# Altium project PCB_Project.PrjPcb (part 2 of 4)

## Sheet ST-LINK.SchDoc
size 420 x 297 mm; Date: 22.03.2024; ApprovedBy: Arda B.; CheckedBy: Arda B.; DrawnBy: Arda Bozkurt; Revision: 001; SheetNumber: 6; SheetTotal: 9; Size: A3; Departmant: HDD; DOC_NO_ASSY_: __; Time: 22.03.2024
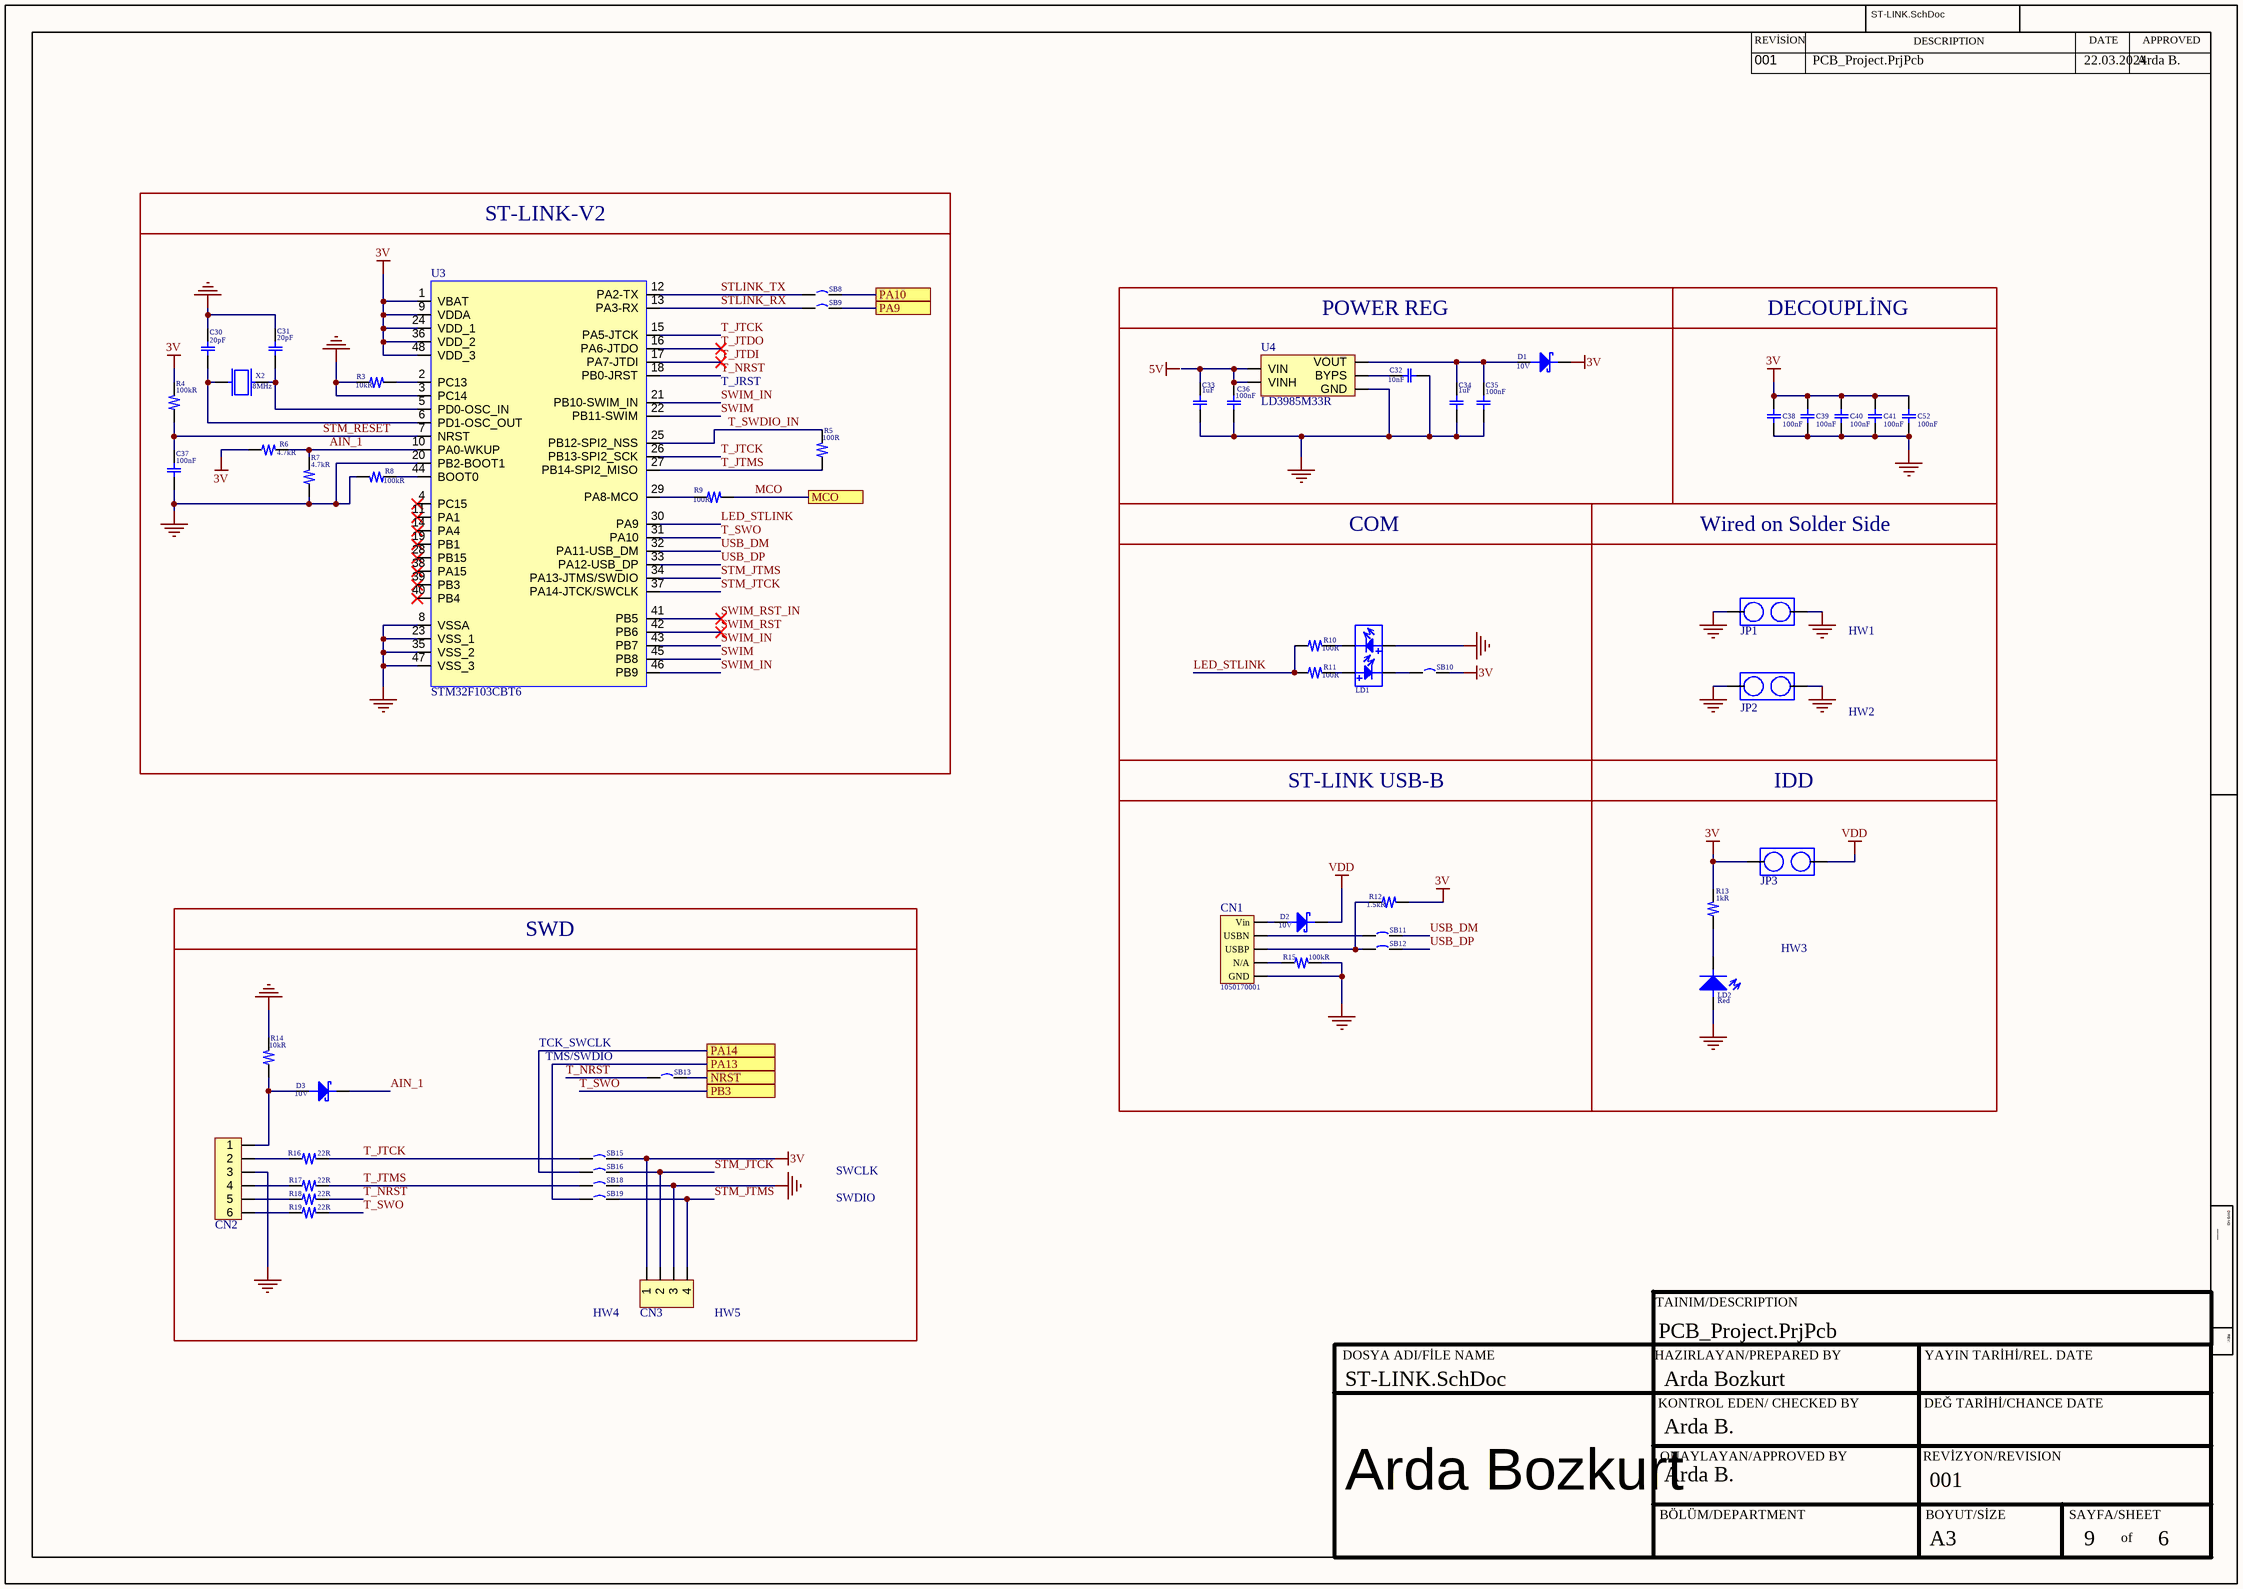
[diagram p5: ST-LINK.SchDoc]

### Parts
C30  value 20pF  [CAP-0402]  (hidden comment: CC0402JRNPO9BN200)
C31  value 20pF  [CAP-0402]  (hidden comment: CC0402JRNPO9BN200)
C32  value 10nF  [CAP-0603]  (hidden comment: CC0603KRX7R9BB103)
C33  value 1uF  [CAP-0603]  (hidden comment: CC0603KRX5R8BB105)
C34  value 1uF  [CAP-0603]  (hidden comment: CC0603KRX5R8BB105)
C35  value 100nF  [CAP-0402]  (hidden comment: CC0402KRX7R7BB104)
C36  value 100nF  [CAP-0402]  (hidden comment: CC0402KRX7R7BB104)
C37  value 100nF  [CAP-0402]  (hidden comment: CC0402KRX7R7BB104)
C38  value 100nF  [CAP-0402]  (hidden comment: CC0402KRX7R7BB104)
C39  value 100nF  [CAP-0402]  (hidden comment: CC0402KRX7R7BB104)
C40  value 100nF  [CAP-0402]  (hidden comment: CC0402KRX7R7BB104)
C41  value 100nF  [CAP-0402]  (hidden comment: CC0402KRX7R7BB104)
C52  value 100nF  [CAP-0402]  (hidden comment: CC0402KRX7R7BB104)
CN1  1050170001  [USB MİCRO B]
CN2  TS-106-G-A  [CONN-6POS]  (value not drawn)
CN3  61300411121  [CONN-4POS]  (value not drawn)
D1  Peak Voltage: 10V  [SOD-323]  (hidden comment: BAT60JFILM)
D2  Peak Voltage: 10V  [SOD-323]  (hidden comment: BAT60JFILM)
D3  Peak Voltage: 10V  [SOD-323]  (hidden comment: BAT60JFILM)
HW1  MNT-101-BK-G  [SHUNT]  (value not drawn)
HW2  MNT-101-BK-G  [SHUNT]  (value not drawn)
HW3  MNT-101-BK-G  [SHUNT]  (value not drawn)
HW4  MNT-101-BK-G  [SHUNT]  (value not drawn)
HW5  MNT-101-BK-G  [SHUNT]  (value not drawn)
JP1  61300211121  [CONN-2PİNS]  (value not drawn)
JP2  61300211121  [CONN-2PİNS]  (value not drawn)
JP3  61300211121  [CONN-2PİNS]  (value not drawn)
LD1  67-22SURSYGC/S530-A2/TR8  [LED-RED-GREEN-SMD]  (value not drawn)
LD2  Color: Red  [LED-RED-0603]  (hidden comment: 150060RS75000)
R3  value 10kR  [RES-0402]  (hidden comment: RC0402FR-0710KL)
R4  value 100kR  [RES-0402]  (hidden comment: RC0402FR-07100KL)
R5  value 100R  [RES-0402]  (hidden comment: RC0402FR-07100RL)
R6  value 4.7kR  [RES-0402]  (hidden comment: RC0402FR-074K7L)
R7  value 4.7kR  [RES-0402]  (hidden comment: RC0402FR-074K7L)
R8  value 100kR  [RES-0402]  (hidden comment: RC0402FR-07100KL)
R9  value 100R  [RES-0402]  (hidden comment: RC0402FR-07100RL)
R10  value 100R  [RES-0402]  (hidden comment: RC0402FR-07100RL)
R11  value 100R  [RES-0402]  (hidden comment: RC0402FR-07100RL)
R12  value 1.5kR  [RES-0402]  (hidden comment: RC0402FR-071K5L)
R13  value 1kR  [RES-0402]  (hidden comment: RC0402FR-071KL)
R14  value 10kR  [RES-0402]  (hidden comment: RC0402FR-0710KL)
R15  value 100kR  [RES-0402]  (hidden comment: RC0402FR-07100KL)
R16  value 22R  [RES-0603]  (hidden comment: RC0603FR-0722RL)
R17  value 22R  [RES-0603]  (hidden comment: RC0603FR-0722RL)
R18  value 22R  [RES-0603]  (hidden comment: RC0603FR-0722RL)
R19  value 22R  [RES-0603]  (hidden comment: RC0603FR-0722RL)
SB8  RC0402JR-070RL  [RES-0402]  (value not drawn)
SB9  RC0402JR-070RL  [RES-0402]  (value not drawn)
SB10  RC0402JR-070RL  [RES-0402]  (value not drawn)
SB11  RC0402JR-070RL  [RES-0402]  (value not drawn)
SB12  RC0402JR-070RL  [RES-0402]  (value not drawn)
SB13  RC0402JR-070RL  [RES-0402]  (value not drawn)
SB15  RC0402JR-070RL  [RES-0402]  (value not drawn)
SB16  RC0402JR-070RL  [RES-0402]  (value not drawn)
SB18  RC0402JR-070RL  [RES-0402]  (value not drawn)
SB19  RC0402JR-070RL  [RES-0402]  (value not drawn)
U3  STM32F103CBT6  [LQFP-48]
U4  LD3985M33R  [SOT23-5L]
X2  Frequency: 8MHz  [HC-49US]  (hidden comment: H1OED8K5SC-112YXC-8M)

### Ports
MCO (see TOP[3B]), NRST (see TOP[3B]), PA9 (see TOP[3B]), PA10 (see TOP[3B]), PA13 (see TOP[3B], Micro Controller[4A]), PA14 (see TOP[3B]), PB3 (see TOP[3B])

### Nets
3V: C38.2 C39.2 C40.2 C41.2 C52.2 CN3.1 D1.1 JP3.1 R4.2 R6.1 R12.2 R13.2 SB10.2 SB15.2 U3.1(VBAT) U3.9(VDDA) U3.24(VDD_1) U3.36(VDD_2) U3.48(VDD_3)
GND: C30.2 C31.2 C32.2 C33.1 C34.1 C35.1 C36.1 C37.1 C38.1 C39.1 C40.1 C41.1 C52.1 CN1.5(GND) CN2.3 CN3.3 JP1.1 JP1.2 JP2.1 JP2.2 LD1.1 LD2.2 R3.1 R7.1 R8.2 R14.2 R15.2 SB18.2 U3.3(PC14) U3.8(VSSA) U3.20(PB2-BOOT1) U3.23(VSS_1) U3.35(VSS_2) U3.47(VSS_3) U4.2(GND)
VDD: D2.1 JP3.2
AIN_1: D3.1 R6.2 R7.2 U3.10(PA0-WKUP)
LED_STLINK: R10.1 R11.1 U3.30(PA9)
MCO: R9.2 ; port MCO
NRST: SB13.2 ; port NRST
STLINK_RX: SB9.1 U3.13(PA3-RX)
STLINK_TX: SB8.1 U3.12(PA2-TX)
STM_JTCK: CN3.2 SB16.2 U3.37(PA14-JTCK/SWCLK)
STM_JTMS: CN3.4 SB19.2 U3.34(PA13-JTMS/SWDIO)
STM_RESET: C37.2 R4.1 U3.7(NRST)
SWIM: U3.22(PB11-SWIM) U3.45(PB8)
SWIM_IN: U3.21(PB10-SWIM_IN) U3.43(PB7) U3.46(PB9)
SWIM_RST: U3.42(PB6)
SWIM_RST_IN: U3.41(PB5)
T_JTCK: R16.2 SB15.1 U3.15(PA5-JTCK) U3.26(PB13-SPI2_SCK)
T_JTDI: U3.17(PA7-JTDI)
T_JTDO: U3.16(PA6-JTDO)
T_JTMS: R5.1 R17.2 SB18.1 U3.27(PB14-SPI2_MISO)
T_NRST: R18.2 SB13.1 U3.18(PB0-JRST)
T_SWDIO_IN: R5.2 U3.25(PB12-SPI2_NSS)
T_SWO: R19.2 U3.31(PA10) ; port PB3
USB_DM: SB11.2 U3.32(PA11-USB_DM)
USB_DP: SB12.2 U3.33(PA12-USB_DP)
NetC30_1: C30.1 U3.6(PD1-OSC_OUT) X2.1
NetC31_1: C31.1 U3.5(PD0-OSC_IN) X2.2
NetC32_1: C32.1 U4.4(BYPS)
NetC33_2: C33.2 C36.2 U4.1(VIN) U4.3(VINH)
NetC34_2: C34.2 C35.2 D1.2 U4.5(VOUT)
NetCN1_1: CN1.1(Vin) D2.2
NetCN1_2: CN1.2(USBN) SB11.1
NetCN1_3: CN1.3(USBP) R12.1 SB12.1
NetCN1_4: CN1.4(N/A) R15.1
NetCN2_1: CN2.1 D3.2 R14.1
NetCN2_2: CN2.2 R16.1
NetCN2_4: CN2.4 R17.1
NetCN2_5: CN2.5 R18.1
NetCN2_6: CN2.6 R19.1
NetLD1_2: LD1.2 R10.2
NetLD1_3: LD1.3 R11.2
NetLD1_4: LD1.4 SB10.1
NetLD2_1: LD2.1 R13.1
NetR3_2: R3.2 U3.2(PC13)
NetR8_1: R8.1 U3.44(BOOT0)
NetR9_1: R9.1 U3.29(PA8-MCO)
NetSB8_2: SB8.2 ; port PA10
NetSB9_2: SB9.2 ; port PA9
NetSB16_1: SB16.1 ; port PA14
NetSB19_1: SB19.1 ; port PA13

Not connected (* = marked no-connect by the designer): U3 4(PC15)* 11(PA1)* 14(PA4)* 19(PB1)* 28(PB15)* 38(PA15)* 39(PB3)* 40(PB4)*

### Notes on the sheet
- ST-LINK-V2
- POWER REG
- DECOUPLİNG
- T_JRST
- COM
- Wired on Solder Side
- ST-LINK USB-B
- IDD
- SWD
- TCK_SWCLK
- TMS/SWDIO
- SWCLK
- SWDIO
- Labels drawn without touching a wire or pin: 5V
- REVİSİON
- DESCRIPTION
- DATE
- APPROVED
- DWG NO:
- TAINIM/DESCRIPTION
- REV:
- DOSYA ADI/FİLE NAME
- HAZIRLAYAN/PREPARED BY
- KONTROL EDEN/ CHECKED BY
- YAYIN TARİHİ/REL. DATE
- DEĞ TARİHİ/CHANCE DATE
- ONAYLAYAN/APPROVED BY
- REVİZYON/REVISION
- Arda Bozkurt
- BÖLÜM/DEPARTMENT
- BOYUT/SİZE
- SAYFA/SHEET
- of

### Library data of the parts
C30 C31 = CAP CER 20PF 50V C0G/NPO 0402: Manufacturer: Yageo; Temperature Coefficient: 30ppm/°C; Supplier: Future Electronics; Supplier Part Number: 9739384; Manufacturer Part Number: CC0402JRNPO9BN200; RoHS: Yes; Category: Ceramic Capacitors; Stock: 60000; Pricing: 10000=0,0025, 40000=0,0023, 150000=0,0022, 300000=0,0022, 750000=0,002 (USD); Halogen Free: 5694HalogenFree; ComponentLink1URL: https://datasheet.ciiva.com/176/mlccorderingcode-176360.pdf?src-supplier=Digikey; ComponentLink1Description: https://datasheet.ciiva.com/176/mlccorderingcode-176360.pdf?src-supplier=Digikey; ComponentLink2URL: https://datasheet.ciiva.com/176/mlccorderingcode-176361.pdf?src-supplier=Digikey; ComponentLink2Description: https://datasheet.ciiva.com/176/mlccorderingcode-176361.pdf?src-supplier=Digikey; ComponentLink3URL: https://datasheet.ciiva.com/176/mlccorderingcode-176362.pdf?src-supplier=Digikey; ComponentLink3Description: https://datasheet.ciiva.com/176/mlccorderingcode-176362.pdf?src-supplier=Digikey; ComponentLink4URL: https://datasheet.ciiva.com/7656/1132289-7656614.pdf?src-supplier=Element14; ComponentLink4Description: https://datasheet.ciiva.com/7656/1132289-7656614.pdf?src-supplier=Element14; ComponentLink5URL: https://datasheet.ciiva.com/5427/upy-gp-np0-16v-to-50v-8-3714-5427769.pdf?src-supplier=Mouser; ComponentLink5Description: https://datasheet.ciiva.com/5427/upy-gp-np0-16v-to-50v-8-3714-5427769.pdf?src-supplier=Mouser
C32 = CAP CER 10nF 50V X7R 0603: Multilayer Ceramic Capacitor, 0.01 uF, 50 V, ± 10%, X7R, 0603 [1608 Metric]; Manufacturer: Yageo; Voltage: 50V; Insulation Resistance: 100GR; Supplier: Future Electronics; Supplier Part Number: 4131256; Manufacturer Part Number: CC0603KRX7R9BB103; RoHS: Yes; Category: Ceramic Capacitors; Stock: 5740000; Pricing: 4000=0,0037, 16000=0,0032, 40000=0,0034, 80000=0,003, 120000=0,0033, 160000=0,0029, 500000=0,0031, 1200000=0,0029 (USD); Mounting Technology: Surface Mount; Case/Package: 0603; Pins: 2; Material: Ceramic; Case Code (Metric): 1608; Case Code (Imperial): 0603; Min Operating Temperature: -55°C; Max Operating Temperature: 125°C; Tolerance: 10%; Dielectric: X7R; Packaging: Tape and Reel; Voltage Rating: 50V; Voltage Rating (DC): 50V; Package Quantity: 1; Termination: SMD/SMT; Series: CC; Length: 1.6mm; Width: 0.031inch; Height: 0.8mm; Thickness: 0.035inch; Depth: 0.8mm; Radiation Hardening: No; RoHS Compliant: Yes; Reach SVHC Compliant: Unknown; Halogen Free: 5694HalogenFree; Lead Free: 5697LeadFree; ComponentLink1URL: https://datasheet.ciiva.com/11788/0900766b8079c870-11788374.pdf?src-supplier=Rs; ComponentLink1Description: https://datasheet.ciiva.com/11788/0900766b8079c870-11788374.pdf?src-supplier=Rs; ComponentLink2URL: https://datasheet.ciiva.com/26862/getdatasheetpartid-403582-26862846.pdf?src-supplier=Verical; ComponentLink2Description: https://datasheet.ciiva.com/26862/getdatasheetpartid-403582-26862846.pdf?src-supplier=Verical; ComponentLink3URL: https://datasheet.ciiva.com/8033/70765-8033817.pdf?src-supplier=Element14; ComponentLink3Description: https://datasheet.ciiva.com/8033/70765-8033817.pdf?src-supplier=Element14; ComponentLink4URL: https://datasheet.ciiva.com/28450/1489800-28450619.pdf?src-supplier=Element14; ComponentLink4Description: https://datasheet.ciiva.com/28450/1489800-28450619.pdf?src-supplier=Element14; ComponentLink5URL: https://datasheet.ciiva.com/176/mlccorderingcode-176550.pdf?src-supplier=Digikey; ComponentLink5Description: https://datasheet.ciiva.com/176/mlccorderingcode-176550.pdf?src-supplier=Digikey; ComponentLink6URL: https://datasheet.ciiva.com/176/mlccorderingcode-176552.pdf?src-supplier=Digikey; ComponentLink6Description: https://datasheet.ciiva.com/176/mlccorderingcode-176552.pdf?src-supplier=Digikey; ComponentLink7URL: https://datasheet.ciiva.com/8033/1734573-8033816.pdf?src-supplier=Element14; ComponentLink7Description: https://datasheet.ciiva.com/8033/1734573-8033816.pdf?src-supplier=Element14; ComponentLink8URL: https://datasheet.ciiva.com/8033/1734573-8033861.pdf?src-supplier=Element14; ComponentLink8Description: https://datasheet.ciiva.com/8033/1734573-8033861.pdf?src-supplier=Element14; ComponentLink9URL: https://datasheet.ciiva.com/176/mlccorderingcode-176551.pdf?src-supplier=Digikey; ComponentLink9Description: https://datasheet.ciiva.com/176/mlccorderingcode-176551.pdf?src-supplier=Digikey; ComponentLink10URL: https://datasheet.ciiva.com/13389/upy-gphc-x7r-6-3v-to-50v-8-13389991.pdf?src-supplier=Mouser; ComponentLink10Description: https://datasheet.ciiva.com/13389/upy-gphc-x7r-6-3v-to-50v-8-13389991.pdf?src-supplier=Mouser
C33 C34 = CAP CER 1UF 25V X5R 0603: Multilayer Ceramic Capacitor, 1 uF, 25 V, ± 10%, X5R, 0603 [1608 Metric]; Manufacturer: Yageo; Material: 4241ConductorMaterial; Voltage Rating: 25V; Supplier: Future Electronics; Supplier Part Number: 5636071; Manufacturer Part Number: CC0603KRX5R8BB105; RoHS: Yes; Category: Ceramic Capacitors; Stock: 3696000; Pricing: 4000=0,0113, 16000=0,0107, 40000=0,0104, 100000=0,0101, 160000=0,0095 (USD); Mounting Technology: Surface Mount; Case/Package: 0603; Pins: 2; Case Code (Metric): 1608; Case Code (Imperial): 0603; Min Operating Temperature: -55°C; Max Operating Temperature: 85°C; Tolerance: 10%; Dielectric: X5R; Packaging: Tape and Reel; Termination: SMD/SMT; Series: CC; Construction: Flat; Voltage Rating (DC): 25V; Length: 1.6mm; Height: 0.8mm; Depth: 0.8mm; Radiation Hardening: No; Reach SVHC Compliant: No; RoHS Compliant: Yes; Halogen Free: 5694HalogenFree; Lead Free: 5697LeadFree; ComponentLink1URL: https://datasheet.ciiva.com/7978/1525783-7978171.pdf?src-supplier=Element14; ComponentLink1Description: https://datasheet.ciiva.com/7978/1525783-7978171.pdf?src-supplier=Element14; ComponentLink2URL: https://datasheet.ciiva.com/176/mlccorderingcode-176786.pdf?src-supplier=Digikey; ComponentLink2Description: https://datasheet.ciiva.com/176/mlccorderingcode-176786.pdf?src-supplier=Digikey; ComponentLink3URL: https://datasheet.ciiva.com/176/mlccorderingcode-176785.pdf?src-supplier=Digikey; ComponentLink3Description: https://datasheet.ciiva.com/176/mlccorderingcode-176785.pdf?src-supplier=Digikey; ComponentLink4URL: https://datasheet.ciiva.com/176/mlccorderingcode-176787.pdf?src-supplier=Digikey; ComponentLink4Description: https://datasheet.ciiva.com/176/mlccorderingcode-176787.pdf?src-supplier=Digikey; ComponentLink5URL: https://datasheet.ciiva.com/11586/upy-gphc-x5r-4v-to-50v-12-11586318.pdf?src-supplier=Avnet; ComponentLink5Description: https://datasheet.ciiva.com/11586/upy-gphc-x5r-4v-to-50v-12-11586318.pdf?src-supplier=Avnet
C35-C41 C52 = CAP CER 100nF 16V X7R 0402: Multilayer Ceramic Capacitor, 0.1 uF, 25 V, ± 10%, X7R, 0402 [1005 Metric]; Manufacturer: Yageo; Material: 4241ConductorMaterial; Voltage Rating: 16V; Temperature Coefficient: 30ppm/°C; Supplier: Future Electronics; Supplier Part Number: 8517856; Manufacturer Part Number: CC0402KRX7R7BB104; RoHS: Yes; Category: Ceramic Capacitors; Stock: 30330000; Pricing: 10000=0,0028, 40000=0,0027, 150000=0,0025, 300000=0,0025, 750000=0,0023 (USD); Mounting Technology: Surface Mount; Case/Package: 0402; Pins: 2; Case Code (Metric): 1005; Case Code (Imperial): 0402; Min Operating Temperature: -55°C; Max Operating Temperature: 125°C; Tolerance: 10%; Dielectric: X7R; Voltage Rating (DC): 16V; Packaging: Tape and Reel; Package Quantity: 1; Termination: SMD/SMT; Voltage: 16V; Series: CC; Voltage Rating (AC): 16V; Length: 1mm; Width: 0.02inch; Height: 0.5mm; Thickness: 0.022inch; Depth: 0.5mm; Radiation Hardening: No; RoHS Compliant: Yes; Reach SVHC Compliant: No; Halogen Free: 5694HalogenFree; Lead Free: 5697LeadFree; ComponentLink1URL: https://datasheet.ciiva.com/11788/0900766b80ce67ed-11788364.pdf?src-supplier=Rs; ComponentLink1Description: https://datasheet.ciiva.com/11788/0900766b80ce67ed-11788364.pdf?src-supplier=Rs; ComponentLink2URL: https://datasheet.ciiva.com/7978/1489800-7978111.pdf?src-supplier=Element14; ComponentLink2Description: https://datasheet.ciiva.com/7978/1489800-7978111.pdf?src-supplier=Element14; ComponentLink3URL: https://datasheet.ciiva.com/161/mlccorderingcode-161545.pdf?src-supplier=Digikey; ComponentLink3Description: https://datasheet.ciiva.com/161/mlccorderingcode-161545.pdf?src-supplier=Digikey; ComponentLink4URL: https://datasheet.ciiva.com/161/mlccorderingcode-161544.pdf?src-supplier=Digikey; ComponentLink4Description: https://datasheet.ciiva.com/161/mlccorderingcode-161544.pdf?src-supplier=Digikey; ComponentLink5URL: https://datasheet.ciiva.com/161/mlccorderingcode-161546.pdf?src-supplier=Digikey; ComponentLink5Description: https://datasheet.ciiva.com/161/mlccorderingcode-161546.pdf?src-supplier=Digikey; ComponentLink6URL: https://datasheet.ciiva.com/8033/1734573-8033661.pdf?src-supplier=Element14; ComponentLink6Description: https://datasheet.ciiva.com/8033/1734573-8033661.pdf?src-supplier=Element14; ComponentLink7URL: https://datasheet.ciiva.com/11587/upy-gphc-x7r-6-3v-to-50v-8-11587305.pdf?src-supplier=Avnet; ComponentLink7Description: https://datasheet.ciiva.com/11587/upy-gphc-x7r-6-3v-to-50v-8-11587305.pdf?src-supplier=Avnet; ComponentLink8URL: https://datasheet.ciiva.com/28450/1489800-28450335.pdf?src-supplier=Element14; ComponentLink8Description: https://datasheet.ciiva.com/28450/1489800-28450335.pdf?src-supplier=Element14; ComponentLink9URL: https://datasheet.ciiva.com/13395/upy-gphc-x7r-6-3v-to-50v-8-13395676.pdf?src-supplier=Mouser; ComponentLink9Description: https://datasheet.ciiva.com/13395/upy-gphc-x7r-6-3v-to-50v-8-13395676.pdf?src-supplier=Mouser; ComponentLink10URL: https://datasheet.ciiva.com/8033/1734573-8033663.pdf?src-supplier=Element14; ComponentLink10Description: https://datasheet.ciiva.com/8033/1734573-8033663.pdf?src-supplier=Element14
CN1 = CONN USB MICRO B SMD: Conn Micro USB 2.0 Type B RCP 5 POS 0.65mm Solder RA SMD 5 Terminal 1 Port Micro-USB T/R; Manufacturer: Molex; Plating: 157ConductorMaterial; Gender: Receptacle; Current Rating: 1.8A; Number of Ports: 1; Number of Contacts: 5; Max Voltage Rating (AC): 30V; USB Standard: USB 2.0; Supplier: Mouser; Supplier Part Number: 538-105017-0001; Manufacturer Part Number: 1050170001; RoHS: Yes; Category: USB Connectors; Stock: 51934; Pricing: 1=0,86, 10=0,736, 50=0,736, 100=0,67, 1000=0,555, 10000=0,495 (USD); Mounting Technology: Surface Mount; Contact Plating: Gold; Contact Material: Copper Alloy,Copper; Housing Material: Polymer; Min Operating Temperature: -30°C; Max Operating Temperature: 85°C; Packaging: Tape and Reel; Termination: Solder; Connector Type: USB; Voltage Rating: 30V; Number of Positions: 5; Orientation: Right Angle; Number of Circuits: 5; Series: 105017; Number of Rows: 1NUMBER; Length: 8.2mm; Pitch: 0.65mm; Depth: 7.5mm; RoHS Compliant: Yes; Reach SVHC Compliant: Unknown; Halogen Free: 5696HalogenFree; ComponentLink1URL: https://datasheet.ciiva.com/3094/1050170001-io-connectors-3094416.pdf?src-supplier=Avnet; ComponentLink1Description: https://datasheet.ciiva.com/3094/1050170001-io-connectors-3094416.pdf?src-supplier=Avnet; ComponentLink2URL: https://datasheet.ciiva.com/4598/1050170001-io-connectors-152207-4598759.pdf?src-supplier=Mouser; ComponentLink2Description: https://datasheet.ciiva.com/4598/1050170001-io-connectors-152207-4598759.pdf?src-supplier=Mouser; ComponentLink3URL: https://datasheet.ciiva.com/851/1050170001-sd-851276.pdf?src-supplier=Digikey; ComponentLink3Description: https://datasheet.ciiva.com/851/1050170001-sd-851276.pdf?src-supplier=Digikey; ComponentLink4URL: https://datasheet.ciiva.com/851/1050170001-sd-851277.pdf?src-supplier=Digikey; ComponentLink4Description: https://datasheet.ciiva.com/851/1050170001-sd-851277.pdf?src-supplier=Digikey; ComponentLink5URL: https://datasheet.ciiva.com/851/1050170001-sd-851278.pdf?src-supplier=Digikey; ComponentLink5Description: https://datasheet.ciiva.com/851/1050170001-sd-851278.pdf?src-supplier=Digikey; ComponentLink6URL: https://datasheet.ciiva.com/16668/1050170001-io-connectors-16668598.pdf?; ComponentLink6Description: https://datasheet.ciiva.com/16668/1050170001-io-connectors-16668598.pdf?
CN2 = CONN 6POS: Conn Unshrouded Header HDR 6 POS 2.54mm Solder ST Top Entry Thru-Hole Tube; Manufacturer: Samtec; Supplier: Mouser; Supplier Part Number: 200-TS106GA; Manufacturer Part Number: TS-106-G-A; RoHS: Yes; Category: Connectors; Stock: 123; Pricing: 1=1,86, 10=1,86, 50=1,86, 100=1,86, 1000=1,14, 10000=0,67 (USD); ComponentLink1URL: https://datasheet.ciiva.com/25618/0900766b8115cecc-25618092.pdf?src-supplier=Rs; ComponentLink1Description: https://datasheet.ciiva.com/25618/0900766b8115cecc-25618092.pdf?src-supplier=Rs; ComponentLink2URL: https://datasheet.ciiva.com/410/tx-1xx-x-x-mkt1-410231.pdf?src-supplier=Digikey; ComponentLink2Description: https://datasheet.ciiva.com/410/tx-1xx-x-x-mkt1-410231.pdf?src-supplier=Digikey; ComponentLink3URL: https://datasheet.ciiva.com/22677/1843794-22677736.pdf?src-supplier=Element14; ComponentLink3Description: https://datasheet.ciiva.com/22677/1843794-22677736.pdf?src-supplier=Element14
CN3 = CONN 4POS GOLD: THT Vertical Pin Header WR-PHD, Pitch 2.54 mm, Single Row, 4 pins; Manufacturer: Wurth Electronics; Number of Positions: 4; Operating Supply Voltage: 250V; Contact Resistance: 20mR; Current Rating: 3A; Gender: 29Gender; Pitch: 0.1inch; Supplier: Farnell; Supplier Part Number: 2356155; Manufacturer Part Number: 61300411121; RoHS: Yes; Category: Headers and Wire Housings; Stock: 4500; Pricing: 100=0,103, 500=0,096, 1000=0,089, 2500=0,087, 5000=0,085, 10000=0,083 (EUR); Mounting Technology: Through Hole; Contact Plating: Gold; Contact Material: Copper; Color: Black; Min Operating Temperature: -40°C; Max Operating Temperature: 105°C; Number of Rows: 1; Packaging: Bulk; Termination: Solder; Number of Contacts: 4; Series: WR-PHD; Contact Type: Male Pin; Orientation: 5495OrientationType; Voltage Rating: 250V; Height: 8.89mm; Contact Mating Length: 0.236inch; RoHS Compliant: Yes; Reach SVHC Compliant: Unknown; Lead Free: 5697LeadFree; ComponentLink1URL: http://www.farnell.com/cad/1737268.pdf?src-supplier=Element14; ComponentLink1Description: http://www.farnell.com/cad/1737268.pdf?src-supplier=Element14; ComponentLink2URL: https://datasheet.octopart.com/61300411121-W%C3%BCrth-Elektronik-datasheet-21154836.pdf?src-supplier=Element14; ComponentLink2Description: https://datasheet.octopart.com/61300411121-W%C3%BCrth-Elektronik-datasheet-21154836.pdf?src-supplier=Element14; ComponentLink3URL: https://katalog.we-online.de/em/datasheet/6130xx11121.pdf?src-supplier=Digikey; ComponentLink3Description: https://katalog.we-online.de/em/datasheet/6130xx11121.pdf?src-supplier=Digikey
D1-D3 = DIODE SCHOTTKY 10V 3A SOD323: Rectifier Diode, Schottky, 1 Phase, 1 Element, 3A, 10V V(RRM), Silicon; Manufacturer: STMicroelectronics; Supplier: Mouser; Supplier Part Number: 511-BAT60JFILM; Manufacturer Part Number: BAT60JFILM; RoHS: Yes; Category: Rectifier Diodes; Stock: 21401; Pricing: 1=0,34, 10=0,237, 50=0,237, 100=0,104, 1000=0,076, 10000=0,054 (USD); ComponentLink1URL: https://datasheet.ciiva.com/4714/cd00001944-96586-4714681.pdf?src-supplier=Mouser; ComponentLink1Description: https://datasheet.ciiva.com/4714/cd00001944-96586-4714681.pdf?src-supplier=Mouser; ComponentLink2URL: https://datasheet.ciiva.com/1200/1689728-1200741.pdf?src-supplier=Farnell; ComponentLink2Description: https://datasheet.ciiva.com/1200/1689728-1200741.pdf?src-supplier=Farnell; ComponentLink3URL: https://datasheet.ciiva.com/17078/bat60jfilm-17078717.pdf?src-supplier=Allied+Electronics; ComponentLink3Description: https://datasheet.ciiva.com/17078/bat60jfilm-17078717.pdf?src-supplier=Allied+Electronics; ComponentLink4URL: https://datasheet.ciiva.com/23916/cd00001944-23916545.pdf?src-supplier=Newark; ComponentLink4Description: https://datasheet.ciiva.com/23916/cd00001944-23916545.pdf?src-supplier=Newark; ComponentLink5URL: https://datasheet.ciiva.com/15144/getdatasheetpartid-91415-15144683.pdf?src-supplier=Verical; ComponentLink5Description: https://datasheet.ciiva.com/15144/getdatasheetpartid-91415-15144683.pdf?src-supplier=Verical; ComponentLink6URL: https://datasheet.ciiva.com/915/cd00001944-915607.pdf?src-supplier=Digikey; ComponentLink6Description: https://datasheet.ciiva.com/915/cd00001944-915607.pdf?src-supplier=Digikey; ComponentLink7URL: https://datasheet.ciiva.com/915/cd00001944-915608.pdf?src-supplier=Digikey; ComponentLink7Description: https://datasheet.ciiva.com/915/cd00001944-915608.pdf?src-supplier=Digikey; ComponentLink8URL: https://datasheet.ciiva.com/915/cd00001944-915609.pdf?src-supplier=Digikey; ComponentLink8Description: https://datasheet.ciiva.com/915/cd00001944-915609.pdf?src-supplier=Digikey
HW1-HW5 = SHUNT: MNT - Samtec 2.54mm Multi Position Jumper Link / Shunt; Supplier: Mouser; Supplier Part Number: 200-MNT101BKG; Manufacturer: Samtec; Manufacturer Part Number: MNT-101-BK-G; RoHS: Yes; Category: Connectors; Stock: 791; Pricing: 1=0,5, 10=0,5, 50=0,39, 100=0,31, 1000=0,21, 10000=0,14 (USD)
JP1-JP3 = CONN HEADER VERT 2POS 2.54MM: THT Vertical Pin Header WR-PHD, Pitch 2.54 mm, Single Row, 2 pins; Manufacturer: Wurth Electronics; Current Rating: 3A; Voltage Rating: 250V; Number of Positions: 2; Gender: 29Gender; Contact Resistance: 20mR; Pitch: 0.1inch; Supplier: Farnell; Supplier Part Number: 2356153; Manufacturer Part Number: 61300211121; RoHS: Yes; Category: Headers and Wire Housings; Stock: 158275; Pricing: 100=0,074, 500=0,067, 1000=0,061, 2500=0,06, 5000=0,059, 10000=0,057 (EUR); Mounting Technology: Through Hole; Contact Plating: Gold; Housing Material: PBT; Contact Material: Copper Alloy,Copper; Color: Black; Min Operating Temperature: -40°C; Max Operating Temperature: 125°C; Number of Rows: 1; Contact Gender: Male; Packaging: Bulk; Termination: Through Hole; Number of Contacts: 2; Series: WR-PHD; Contact Type: Male Pin; Operating Supply Voltage: 250V; Orientation: 5495OrientationType; Height: 8.94mm; Contact Mating Length: 0.236inch; RoHS Compliant: Yes; Reach SVHC Compliant: Unknown; Lead Free: 5697LeadFree; ComponentLink1URL: https://datasheet.ciiva.com/13619/6130xx11121-48870-13619345.pdf?src-supplier=Mouser; ComponentLink1Description: https://datasheet.ciiva.com/13619/6130xx11121-48870-13619345.pdf?src-supplier=Mouser
LD1 = LED Red/Yellow-Green SMD: LED Bi-Color Red/Yellow Green 632nm/575nm 4-Pin PLCC T/R; Manufacturer: Everlight; Color: Green,Red,Yellow; Wavelength: 573nm; Lens Style: Diffused,Colorless,Circular; Viewing Angle: 130°; Number of LEDs: 2; Supplier: Avnet; Supplier Part Number: 67-22SURSYGC/S530-A2/TR8; Manufacturer Part Number: 67-22SURSYGC/S530-A2/TR8; RoHS: Yes; Category: LEDs; Pricing: 6000=0,35351, 10000=0,34853, 16000=0,33857, 30000=0,3311, 60000=0,20278, 300000=0,19803, 600000=0,17717 (USD); Mounting Technology: Surface Mount; Case/Package: PLCC; Pins: 4; Packaging: Tape and Reel; Package Quantity: 2000; Length: 3.2mm; Width: 2.7mm; Height: 1.9mm; Radiation Hardening: No; RoHS Compliant: Yes; ComponentLink1URL: https://datasheet.ciiva.com/29281/156339-da-01-en-led-plcc4-bic-67-22sursygc-s530-a2-tr8-29281476.pdf?src-supplier=Conrad; ComponentLink1Description: https://datasheet.ciiva.com/29281/156339-da-01-en-led-plcc4-bic-67-22sursygc-s530-a2-tr8-29281476.pdf?src-supplier=Conrad
LD2 = LED RED CLEAR 0603 SMD: LED Low-Power Uni-Color Red 630nm 2V 2-Pin Chip 0603(1608Metric) T/R; Manufacturer: Wurth Electronics; Lens Color: Colorless; Viewing Angle: 140°; Lens Style: Clear,Flat,Rectangular; Luminous Intensity: 250mcd; Forward Current: 30mA; Wavelength: 625nm; Test Current: 20mA; Lens Transparency: Clear; Max Reverse Voltage (DC): 5V; Power Dissipation: 72mW; Lens Size: 0.7mm; Supplier: Farnell; Supplier Part Number: 2322071; Manufacturer Part Number: 150060RS75000; RoHS: Yes; Category: LEDs; Stock: 28909; Pricing: 5=0,164, 10=0,147, 100=0,121, 500=0,11, 1000=0,108 (EUR); Mounting Technology: Surface Mount; Case/Package: 0603; Case Code (Metric): 1608; Case Code (Imperial): 0603; Min Operating Temperature: -40°C; Max Operating Temperature: 85°C; Package Quantity: 1; Packaging: Cut Tape; Forward Voltage: 2V; Dominant Wavelength: 625nm; Series: WL-SMCW; Reverse Voltage: 5V; Length: 1.6mm; Width: 0.8mm; Height: 0.8mm; RoHS Compliant: Yes; Reach SVHC Compliant: Unknown; ComponentLink1URL: https://datasheet.ciiva.com/29563/150060rs75000-29563040.pdf?src-supplier=Digikey; ComponentLink1Description: https://datasheet.ciiva.com/29563/150060rs75000-29563040.pdf?src-supplier=Digikey; ComponentLink2URL: https://datasheet.ciiva.com/29279/759428-da-01-en-chipled-0603-w-kl-rot-150060rs75000-29279196.pdf?src-supplier=Conrad; ComponentLink2Description: https://datasheet.ciiva.com/29279/759428-da-01-en-chipled-0603-w-kl-rot-150060rs75000-29279196.pdf?src-supplier=Conrad
R3 R14 = RES 10K OHM 1% 1/16W 0402: SMD Chip Resistor, 10 kOhm, ± 1%, 63 mW, 0402 [1005 Metric], Thick Film, General Purpose; Manufacturer: Yageo; Voltage Rating (DC): 50V; Temperature Coefficient: 100ppm/°C; Power Rating: 62.5mW; Max Power Dissipation: 63mW; Supplier: Future Electronics; Supplier Part Number: 3388022; Manufacturer Part Number: RC0402FR-0710KL; RoHS: Yes; Category: Chip SMD Resistors; Stock: 56000000; Pricing: 10000=0,0012, 100000=0,0011, 300000=0,001, 750000=0,001, 2000000=0,0009 (USD); Case/Package: 0402; Pins: 2; Case Code (Imperial): 0402; Case Code (Metric): 1005; Min Operating Temperature: -55°C; Max Operating Temperature: 155°C; Resistor Type: Thick Film; Voltage Rating: 50V; Tolerance: 1%; Packaging: Tape and Reel; Termination: SMD/SMT; Series: RC; Number of Terminations: 2; Features: Moisture Resistant; Resistance Tolerance: 1%; Construction: Rectangular; Length: 1mm; Width: 0.5mm; Depth: 0.5mm; Lead Pitch: 0.2mm; RoHS Compliant: Yes; Reach SVHC Compliant: Unknown; Lead Free: 5697LeadFree; Military Standard: Not; ComponentLink1URL: https://datasheet.ciiva.com/7660/38568-7660787.pdf?src-supplier=Element14; ComponentLink1Description: https://datasheet.ciiva.com/7660/38568-7660787.pdf?src-supplier=Element14; ComponentLink2URL: https://datasheet.ciiva.com/7849/1686128-7849814.pdf?src-supplier=Element14; ComponentLink2Description: https://datasheet.ciiva.com/7849/1686128-7849814.pdf?src-supplier=Element14; ComponentLink3URL: https://datasheet.ciiva.com/7983/1018594-7983486.pdf?src-supplier=Element14; ComponentLink3Description: https://datasheet.ciiva.com/7983/1018594-7983486.pdf?src-supplier=Element14
R4 R8 R15 = RES 100K OHM 1% 1/16W 0402: SMD Chip Resistor, 100 kOhm, ± 1%, 63 mW, 0402 [1005 Metric], Thick Film, General Purpose; Manufacturer: Yageo; Temperature Coefficient: 100ppm/°C; Power Rating: 63mW; Voltage Rating: 50V; Supplier: Future Electronics; Supplier Part Number: 6468466; Manufacturer Part Number: RC0402FR-07100KL; RoHS: Yes; Category: Chip SMD Resistors; Stock: 35770000; Pricing: 10000=0,0019, 100000=0,0018, 300000=0,0017, 750000=0,0016, 2000000=0,0015 (USD); Case/Package: 0402; Case Code (Metric): 1005; Case Code (Imperial): 0402; Min Operating Temperature: -55°C; Max Operating Temperature: 155°C; Resistor Type: Thick Film; Tolerance: 1%; Packaging: Tape and Reel; Package Quantity: 1; Number of Terminations: 2; Termination: SMD/SMT; Max Power Dissipation: 63mW; Features: Moisture Resistant; Series: RC; Resistance Tolerance: 1%; Construction: Rectangular; Technology: THICK FILM; Voltage Rating (AC): 50V; Length: 0.039inch; Width: 0.02inch; Height: 0.016inch; Depth: 0.5mm; Reach SVHC Compliant: No; RoHS Compliant: Yes; Lead Free: 5697LeadFree; Military Standard: Not; ComponentLink1URL: https://datasheet.ciiva.com/11819/0900766b80c66297-11819452.pdf?src-supplier=Rs; ComponentLink1Description: https://datasheet.ciiva.com/11819/0900766b80c66297-11819452.pdf?src-supplier=Rs; ComponentLink2URL: https://datasheet.ciiva.com/22747/1018594-22747509.pdf?src-supplier=Element14; ComponentLink2Description: https://datasheet.ciiva.com/22747/1018594-22747509.pdf?src-supplier=Element14; ComponentLink3URL: https://datasheet.ciiva.com/2453/pyu-r-int-thick-7-2453362.pdf?src-supplier=Digikey; ComponentLink3Description: https://datasheet.ciiva.com/2453/pyu-r-int-thick-7-2453362.pdf?src-supplier=Digikey; ComponentLink4URL: https://datasheet.ciiva.com/2453/pyu-r-int-thick-7-2453363.pdf?src-supplier=Digikey; ComponentLink4Description: https://datasheet.ciiva.com/2453/pyu-r-int-thick-7-2453363.pdf?src-supplier=Digikey; ComponentLink5URL: https://datasheet.ciiva.com/2453/pyu-r-int-thick-7-2453361.pdf?src-supplier=Digikey; ComponentLink5Description: https://datasheet.ciiva.com/2453/pyu-r-int-thick-7-2453361.pdf?src-supplier=Digikey; ComponentLink6URL: https://datasheet.ciiva.com/12667/pyu-rc0402-51-rohs-l-6-r-12667930.pdf?src-supplier=Mouser; ComponentLink6Description: https://datasheet.ciiva.com/12667/pyu-rc0402-51-rohs-l-6-r-12667930.pdf?src-supplier=Mouser; ComponentLink7URL: https://datasheet.ciiva.com/15189/getdatasheetpartid-323696-15189334.pdf?src-supplier=Verical; ComponentLink7Description: https://datasheet.ciiva.com/15189/getdatasheetpartid-323696-15189334.pdf?src-supplier=Verical
R5 R9-R11 = RES 100 OHM 1% 1/16W 0402: SMD Chip Resistor, 100 Ohm, ± 1%, 63 mW, 0402 [1005 Metric], Thick Film, General Purpose; Manufacturer: Yageo; Power Rating: 62.5mW; Voltage Rating: 50V; Temperature Coefficient: 100ppm/°C; Max Power Dissipation: 63mW; Supplier: Future Electronics; Supplier Part Number: 2266856; Manufacturer Part Number: RC0402FR-07100RL; RoHS: Yes; Category: Chip SMD Resistors; Stock: 3260000; Pricing: 10000=0,0021, 100000=0,002, 300000=0,0019, 750000=0,0019, 2000000=0,0017 (USD); Case/Package: 0402; Pins: 2; Case Code (Imperial): 0402; Case Code (Metric): 1005; Min Operating Temperature: -55°C; Max Operating Temperature: 155°C; Tolerance: 1%; Voltage Rating (DC): 50V; Packaging: Tape and Reel; Termination: SMD/SMT; Resistor Type: Thick Film; Features: Moisture Resistant; Series: RC; Number of Terminations: 2; Resistance Tolerance: 1%; Construction: Rectangular; Technology: THICK FILM; Length: 1mm; Width: 0.5mm; Height: 0.32mm; Depth: 0.5mm; RoHS Compliant: Yes; Reach SVHC Compliant: No; Military Standard: Not; Lead Free: Lead Free; ComponentLink1URL: https://datasheet.ciiva.com/7849/1784430-7849810.pdf?src-supplier=Element14; ComponentLink1Description: https://datasheet.ciiva.com/7849/1784430-7849810.pdf?src-supplier=Element14; ComponentLink2URL: https://datasheet.ciiva.com/11808/0900766b80c66297-11808765.pdf?src-supplier=Rs; ComponentLink2Description: https://datasheet.ciiva.com/11808/0900766b80c66297-11808765.pdf?src-supplier=Rs; ComponentLink3URL: https://datasheet.ciiva.com/28367/1018594-28367226.pdf?src-supplier=Element14; ComponentLink3Description: https://datasheet.ciiva.com/28367/1018594-28367226.pdf?src-supplier=Element14; ComponentLink4URL: https://datasheet.ciiva.com/22747/1018594-22747511.pdf?src-supplier=Element14; ComponentLink4Description: https://datasheet.ciiva.com/22747/1018594-22747511.pdf?src-supplier=Element14; ComponentLink5URL: https://datasheet.ciiva.com/12667/pyu-rc0402-51-rohs-l-6-r-12667957.pdf?src-supplier=Mouser; ComponentLink5Description: https://datasheet.ciiva.com/12667/pyu-rc0402-51-rohs-l-6-r-12667957.pdf?src-supplier=Mouser; ComponentLink6URL: https://datasheet.ciiva.com/16740/pyu-rc0402-51-rohs-l-6-r-16740566.pdf?src-supplier=Future+Electronics; ComponentLink6Description: https://datasheet.ciiva.com/16740/pyu-rc0402-51-rohs-l-6-r-16740566.pdf?src-supplier=Future+Electronics; ComponentLink7URL: https://datasheet.ciiva.com/15189/getdatasheetpartid-329466-15189335.pdf?src-supplier=Verical; ComponentLink7Description: https://datasheet.ciiva.com/15189/getdatasheetpartid-329466-15189335.pdf?src-supplier=Verical
R6 R7 = RES 4.7K OHM 1% 1/16W 0402: SMD Chip Resistor, 4.7 kOhm, ± 1%, 63 mW, 0402 [1005 Metric], Thick Film, General Purpose; Manufacturer: Yageo; Voltage Rating (DC): 50V; Power Rating: 62.5mW; Temperature Coefficient: 100ppm/°C; Max Power Dissipation: 63mW; Supplier: Future Electronics; Supplier Part Number: 3795218; Manufacturer Part Number: RC0402FR-074K7L; RoHS: Yes; Category: Chip SMD Resistors; Stock: 7100000; Pricing: 10000=0,0012, 100000=0,0011, 300000=0,001, 750000=0,001, 2000000=0,0009 (USD); Case/Package: 0402; Pins: 2; Case Code (Imperial): 0402; Case Code (Metric): 1005; Min Operating Temperature: -55°C; Max Operating Temperature: 155°C; Tolerance: 1%; Voltage Rating: 50V; Packaging: Tape and Reel; Resistor Type: Thick Film; Termination: SMD/SMT; Features: Moisture Resistant; Series: RC; Number of Terminations: 2; Resistance Tolerance: 1%; Construction: Rectangular; Voltage Rating (AC): 50V; Length: 1mm; Width: 0.5mm; Depth: 0.5mm; RoHS Compliant: Yes; Reach SVHC Compliant: No; Military Standard: Not; Lead Free: Lead Free; ComponentLink1URL: https://datasheet.ciiva.com/22661/1686128-22661342.pdf?src-supplier=Element14; ComponentLink1Description: https://datasheet.ciiva.com/22661/1686128-22661342.pdf?src-supplier=Element14; ComponentLink2URL: https://datasheet.ciiva.com/7850/1018594-7850022.pdf?src-supplier=Element14; ComponentLink2Description: https://datasheet.ciiva.com/7850/1018594-7850022.pdf?src-supplier=Element14; ComponentLink3URL: https://datasheet.ciiva.com/7850/1018594-7850023.pdf?src-supplier=Element14; ComponentLink3Description: https://datasheet.ciiva.com/7850/1018594-7850023.pdf?src-supplier=Element14; ComponentLink4URL: https://datasheet.ciiva.com/15215/getdatasheetpartid-328119-15215035.pdf?src-supplier=Verical; ComponentLink4Description: https://datasheet.ciiva.com/15215/getdatasheetpartid-328119-15215035.pdf?src-supplier=Verical
R12 = RES 1.5K OHM 1% 1/16W 0402: SMD Chip Resistor, 1.5 kOhm, ± 1%, 63 mW, 0402 [1005 Metric], Thick Film, General Purpose; Manufacturer: Yageo; Power Rating: 62.5mW; Voltage Rating: 50V; Temperature Coefficient: 100ppm/°C; Max Power Dissipation: 63mW; Supplier: Future Electronics; Supplier Part Number: 4582714; Manufacturer Part Number: RC0402FR-071K5L; RoHS: Yes; Category: Chip SMD Resistors; Stock: 1020000; Pricing: 10000=0,0012, 100000=0,0011, 300000=0,001, 750000=0,001, 2000000=0,0009 (USD); Case/Package: 0402; Case Code (Metric): 1005; Case Code (Imperial): 0402; Min Operating Temperature: -55°C; Max Operating Temperature: 155°C; Resistor Type: Thick Film; Package Quantity: 1; Tolerance: 1%; Packaging: Tape and Reel; Number of Terminations: 2; Termination: SMD/SMT; Features: Moisture Resistant; Series: RC; Resistance Tolerance: 1%; Construction: Rectangular; Technology: THICK FILM; Voltage Rating (AC): 50V; Length: 1mm; Width: 0.02inch; Height: 0.016inch; Depth: 0.5mm; RoHS Compliant: Yes; Reach SVHC Compliant: No; Military Standard: Not; Lead Free: 5697LeadFree; ComponentLink1URL: https://datasheet.ciiva.com/11808/0900766b80c66297-11808238.pdf?src-supplier=Rs; ComponentLink1Description: https://datasheet.ciiva.com/11808/0900766b80c66297-11808238.pdf?src-supplier=Rs; ComponentLink2URL: https://datasheet.ciiva.com/46394/1018594-46394950.pdf?src-supplier=Element14; ComponentLink2Description: https://datasheet.ciiva.com/46394/1018594-46394950.pdf?src-supplier=Element14; ComponentLink3URL: https://datasheet.ciiva.com/2453/pyu-r-int-thick-7-2453440.pdf?src-supplier=Digikey; ComponentLink3Description: https://datasheet.ciiva.com/2453/pyu-r-int-thick-7-2453440.pdf?src-supplier=Digikey; ComponentLink4URL: https://datasheet.ciiva.com/2453/pyu-r-int-thick-7-2453441.pdf?src-supplier=Digikey; ComponentLink4Description: https://datasheet.ciiva.com/2453/pyu-r-int-thick-7-2453441.pdf?src-supplier=Digikey; ComponentLink5URL: https://datasheet.ciiva.com/2453/pyu-r-int-thick-7-2453439.pdf?src-supplier=Digikey; ComponentLink5Description: https://datasheet.ciiva.com/2453/pyu-r-int-thick-7-2453439.pdf?src-supplier=Digikey; ComponentLink6URL: https://datasheet.ciiva.com/12558/pyu-rc0402-51-rohs-l-6-r-8721-12558542.pdf?src-supplier=Mouser; ComponentLink6Description: https://datasheet.ciiva.com/12558/pyu-rc0402-51-rohs-l-6-r-8721-12558542.pdf?src-supplier=Mouser; ComponentLink7URL: https://datasheet.ciiva.com/7849/1018594-7849863.pdf?src-supplier=Element14; ComponentLink7Description: https://datasheet.ciiva.com/7849/1018594-7849863.pdf?src-supplier=Element14; ComponentLink8URL: https://datasheet.ciiva.com/7849/1018594-7849864.pdf?src-supplier=Element14; ComponentLink8Description: https://datasheet.ciiva.com/7849/1018594-7849864.pdf?src-supplier=Element14; ComponentLink9URL: https://datasheet.ciiva.com/15189/getdatasheetpartid-323992-15189370.pdf?src-supplier=Verical; ComponentLink9Description: https://datasheet.ciiva.com/15189/getdatasheetpartid-323992-15189370.pdf?src-supplier=Verical
R13 = RES 1K OHM 1% 1/16W 0402: SMD Chip Resistor, 1 kOhm, ± 1%, 63 mW, 0402 [1005 Metric], Thick Film, General Purpose; Manufacturer: Yageo; Temperature Coefficient: 100ppm/°C; Voltage Rating (DC): 50V; Power Rating: 62.5mW; Max Power Dissipation: 63mW; Supplier: Future Electronics; Supplier Part Number: 7825607; Manufacturer Part Number: RC0402FR-071KL; RoHS: Yes; Category: Chip SMD Resistors; Stock: 14890000; Pricing: 10000=0,0012, 100000=0,0011, 300000=0,001, 750000=0,001, 2000000=0,0009 (USD); Case/Package: 0402; Pins: 2; Case Code (Imperial): 0402; Case Code (Metric): 1005; Min Operating Temperature: -55°C; Max Operating Temperature: 155°C; Tolerance: 1%; Resistor Type: Thick Film; Packaging: Tape and Reel; Voltage Rating: 50V; Termination: SMD/SMT; Features: Moisture Resistant; Series: RC; Number of Terminations: 2; Resistance Tolerance: 1%; Construction: Rectangular; Technology: THICK FILM; Voltage Rating (AC): 50V; Length: 1mm; Width: 0.5mm; Height: 0.32mm; Depth: 0.5mm; Reach SVHC Compliant: No; Lead Free: 5697LeadFree; RoHS Compliant: Yes; Military Standard: Not; ComponentLink1URL: https://datasheet.ciiva.com/11819/0900766b80c66297-11819477.pdf?src-supplier=Rs; ComponentLink1Description: https://datasheet.ciiva.com/11819/0900766b80c66297-11819477.pdf?src-supplier=Rs; ComponentLink2URL: https://datasheet.ciiva.com/7983/1018594-7983502.pdf?src-supplier=Element14; ComponentLink2Description: https://datasheet.ciiva.com/7983/1018594-7983502.pdf?src-supplier=Element14; ComponentLink3URL: https://datasheet.ciiva.com/22747/1018594-22747513.pdf?src-supplier=Element14; ComponentLink3Description: https://datasheet.ciiva.com/22747/1018594-22747513.pdf?src-supplier=Element14; ComponentLink4URL: https://datasheet.ciiva.com/12666/pyu-rc0402-51-rohs-l-6-r-12666741.pdf?src-supplier=Mouser; ComponentLink4Description: https://datasheet.ciiva.com/12666/pyu-rc0402-51-rohs-l-6-r-12666741.pdf?src-supplier=Mouser; ComponentLink5URL: https://datasheet.ciiva.com/7849/1018594-7849869.pdf?src-supplier=Element14; ComponentLink5Description: https://datasheet.ciiva.com/7849/1018594-7849869.pdf?src-supplier=Element14; ComponentLink6URL: https://datasheet.ciiva.com/7849/1018594-7849871.pdf?src-supplier=Element14; ComponentLink6Description: https://datasheet.ciiva.com/7849/1018594-7849871.pdf?src-supplier=Element14; ComponentLink7URL: https://datasheet.ciiva.com/17063/pyu-rc0402-51-rohs-l-6-r-17063193.pdf?src-supplier=Future+Electronics; ComponentLink7Description: https://datasheet.ciiva.com/17063/pyu-rc0402-51-rohs-l-6-r-17063193.pdf?src-supplier=Future+Electronics
R16-R19 = RES 22 OHM 1% 1/10W 0603: SMD Chip Resistor, 22 Ohm, ± 1%, 100 mW, 0603 [1608 Metric], Thick Film, General Purpose; Manufacturer: Yageo; Temperature Coefficient: 100ppm/°C; Voltage Rating (DC): 50V; Power Rating: 100mW; Output Current: 8A; Min Input Voltage: 1.4V; Supplier: Future Electronics; Supplier Part Number: 8636706; Manufacturer Part Number: RC0603FR-0722RL; RoHS: Yes; Category: Chip SMD Resistors; Stock: 2215000; Pricing: 5000=0,0015, 50000=0,0014, 150000=0,0014, 375000=0,0013, 1000000=0,0012 (USD); Case/Package: 0603; Pins: 2; Case Code (Metric): 1608; Case Code (Imperial): 0603; Min Operating Temperature: -55°C; Max Operating Temperature: 155°C; Tolerance: 1%; Resistor Type: Thick Film; Packaging: Tape and Reel; Voltage Rating: 50V; Package Quantity: 1; Number of Terminations: 2; Termination: SMD/SMT; Max Power Dissipation: 100mW; Features: Moisture Resistant; Series: RC; Resistance Tolerance: 1%; Technology: THICK FILM; Construction: Rectangular; Voltage Rating (AC): 50V; Max Output current: 8A; Length: 0.063inch; Width: 0.031inch; Height: 0.022inch; Depth: 0.8mm; Radiation Hardening: 5898YesNo; Reach SVHC Compliant: No; Lead Free: 5697LeadFree; Military Standard: Not; RoHS Compliant: Yes; ComponentLink1URL: https://datasheet.ciiva.com/11819/0900766b80f96399-11819285.pdf?src-supplier=Rs; ComponentLink1Description: https://datasheet.ciiva.com/11819/0900766b80f96399-11819285.pdf?src-supplier=Rs; ComponentLink2URL: https://datasheet.ciiva.com/46395/443971-46395032.pdf?src-supplier=Element14; ComponentLink2Description: https://datasheet.ciiva.com/46395/443971-46395032.pdf?src-supplier=Element14; ComponentLink3URL: https://datasheet.ciiva.com/46440/1868787-46440901.pdf?src-supplier=Element14; ComponentLink3Description: https://datasheet.ciiva.com/46440/1868787-46440901.pdf?src-supplier=Element14; ComponentLink4URL: https://datasheet.ciiva.com/2454/pyu-r-int-thick-7-2454355.pdf?src-supplier=Digikey; ComponentLink4Description: https://datasheet.ciiva.com/2454/pyu-r-int-thick-7-2454355.pdf?src-supplier=Digikey; ComponentLink5URL: https://datasheet.ciiva.com/2454/pyu-r-int-thick-7-2454356.pdf?src-supplier=Digikey; ComponentLink5Description: https://datasheet.ciiva.com/2454/pyu-r-int-thick-7-2454356.pdf?src-supplier=Digikey; ComponentLink6URL: https://datasheet.ciiva.com/2454/pyu-r-int-thick-7-2454354.pdf?src-supplier=Digikey; ComponentLink6Description: https://datasheet.ciiva.com/2454/pyu-r-int-thick-7-2454354.pdf?src-supplier=Digikey
SB8-SB13 SB15 SB16 SB18 SB19 = RES 0 OHM JUMPER 1/10W 0603: Zero Ohm Resistor, Jumper, 0402 [1005 Metric], Thick Film, 62.5 mW, 1 A, Surface Mount; Manufacturer: Yageo; Manufacturer Part Number: RC0603JR-070RL; Tolerance: 1%; Power Rating: 100mW; Voltage Rating (DC): 50V; Temperature Coefficient: 200ppm/°C; Resistance Tolerance: 5%; Value: 0mR; Supplier: Future Electronics; Supplier Part Number: 3992146; RoHS: Yes; Category: Chip SMD Resistors; Stock: 16200000; Pricing: 5000=0,0016, 50000=0,0014, 100000=0,0015, 150000=0,0014, 375000=0,0014, 1000000=0,0012, 1250000=0,0013, 5000000=0,0012 (USD); Case/Package: 0603; Pins: 2; Contact Plating: Tin,Matte; Case Code (Imperial): 0402; Case Code (Metric): 1608; Min Operating Temperature: -55°C; Max Operating Temperature: 155°C; Resistor Type: Thick Film; Packaging: Tape and Reel; Termination: SMD/SMT; Series: RC; Technology: THICK FILM; Package Quantity: 5000; Voltage Rating: 50V; Features: Moisture Resistant; Max Power Dissipation: 100mW; Number of Terminations: 2; Construction: Rectangular; Length: 1.6mm; Width: 0.8mm; Height: 0.45mm; Depth: 0.8mm; RoHS Compliant: Yes; Reach SVHC Compliant: Unknown; Lead Free: 5697LeadFree; Military Standard: Not
U3 = IC MCU 32BIT 128KB FLASH 48LQFP: ARM Cortex-M3 STM32 F1 Microcontroller 32-Bit 72MHz 128kB FLASH LQFP48 STM32F103CBT6; Manufacturer: STMicroelectronics; RAM Size: 20KB; Max Power Dissipation: 363mW; Interface: I2C,SPI,USB,CAN,IrDA,UART,USART,LIN; Number of I/Os: 37; Number of Timers/Counters: 4; Max Supply Voltage: 3.6V; Number of PWM Channels: 12; Number of ADC Channels: 10; Min Supply Voltage: 2V; Oscillator Type: Internal; Data Bus Width: 32b; Number of Bits: 32; Number of SPI Channels: 2; Watchdog Timer: Yes; Peripherals: POR,PWM,WDT,DMA,Temp Sensor,I2C; Supplier: Mouser; Supplier Part Number: 511-STM32F103CBT6; Manufacturer Part Number: STM32F103CBT6; RoHS: Yes; Category: Microcontrollers; Stock: 5952; Pricing: 1=7,04, 10=6,36, 50=5,27, 100=5,27, 1000=4, 10000=3,92 (USD); Case/Package: LQFP; Pins: 48; Min Operating Temperature: -40°C; Max Operating Temperature: 85°C; Frequency: 72MHz; Package Quantity: 250; Density: 128KB; Packaging: Tray; Number of Programmable I/O: 37; Clock Frequency: 72MHz; Number of I2C Channels: 2; Memory Format: FLASH; Termination: SMD/SMT; Address Bus Width: 32b; Memory Size: 128KB; Core Architecture: ARM; Series: STM32 F1; Length: 7mm; Width: 7.2mm; Height: 1.45mm; Radiation Hardening: No; Reach SVHC Compliant: No; Lead Free: Lead Free; RoHS Compliant: Yes; ComponentLink1URL: https://datasheet.ciiva.com/23669/1714663-23669200.pdf?src-supplier=Newark; ComponentLink1Description: https://datasheet.ciiva.com/23669/1714663-23669200.pdf?src-supplier=Newark; ComponentLink2URL: https://datasheet.ciiva.com/15122/getdatasheetpartid-92132-15122195.pdf?src-supplier=Verical; ComponentLink2Description: https://datasheet.ciiva.com/15122/getdatasheetpartid-92132-15122195.pdf?src-supplier=Verical; ComponentLink3URL: https://datasheet.ciiva.com/5752/cd00161566-5752838.pdf?src-supplier=Farnell; ComponentLink3Description: https://datasheet.ciiva.com/5752/cd00161566-5752838.pdf?src-supplier=Farnell; ComponentLink4URL: https://datasheet.ciiva.com/14100/pustm-arm-microcont-stm32f103-en-14100509.pdf?src-supplier=Distrelec; ComponentLink4Description: https://datasheet.ciiva.com/14100/pustm-arm-microcont-stm32f103-en-14100509.pdf?src-supplier=Distrelec; ComponentLink5URL: https://datasheet.ciiva.com/1502/cd00161566-1502328.pdf?src-supplier=Digikey; ComponentLink5Description: https://datasheet.ciiva.com/1502/cd00161566-1502328.pdf?src-supplier=Digikey; ComponentLink6URL: https://datasheet.ciiva.com/4840/cd00161566-4840398.pdf?src-supplier=Mouser; ComponentLink6Description: https://datasheet.ciiva.com/4840/cd00161566-4840398.pdf?src-supplier=Mouser; ComponentLink7URL: https://datasheet.ciiva.com/16219/cd00161566-16219150.pdf?src-supplier=Future+Electronics; ComponentLink7Description: https://datasheet.ciiva.com/16219/cd00161566-16219150.pdf?src-supplier=Future+Electronics
U4 = IC REG LINEAR 3.3V 150MA SOT23-5: LD3985 Series 150 mA 3.3 V Fixed Low Noise LDO BiCMOS Regulator-SOT-23-5; Manufacturer: STMicroelectronics; Min Input Voltage: 2.5V; Number of Outputs: 1; Max Supply Voltage: 6V; Output Voltage: 3.3V; Polarity: Positive; Quiescent Current: 150uA; Dropout Voltage: 400uV; Output Current: 150mA; Input Bias Current: 85uA; Max Supply Current: 250uA; Power Supply Rejection Ratio (PSRR): 50dB; Number of Channels: 1NUMBER; Supplier: Mouser; Supplier Part Number: 511-LD3985M33R; Manufacturer Part Number: LD3985M33R; RoHS: Yes; Category: Voltage Regulators - Linear; Stock: 69742; Pricing: 1=0,89, 10=0,793, 50=0,753, 100=0,618, 1000=0,403, 10000=0,343 (USD); Mounting Technology: Surface Mount; Case/Package: SOT-23-5; Pins: 5; Weight: 0.000222oz; Min Operating Temperature: -40°C; Max Operating Temperature: 125°C; Output Type: Fixed; Packaging: Cut Tape; Package Quantity: 3000; Number of Regulators: 1; Min Output Voltage: 3.3V; Series: -; Output Configuration: Positive; Min Supply Voltage: 2.5V; Length: 3mm; Width: 1.75mm; Height: 1.3mm; Lead Free: Lead Free; RoHS Compliant: Yes; ComponentLink1URL: https://datasheet.ciiva.com/41440/001185181-da-01-en-ic-reg-ldo-3-3v-ld3985m33r-sot-23-5-stm-41440289.pdf?src-supplier=Conrad; ComponentLink1Description: https://datasheet.ciiva.com/41440/001185181-da-01-en-ic-reg-ldo-3-3v-ld3985m33r-sot-23-5-stm-41440289.pdf?src-supplier=Conrad; ComponentLink2URL: https://datasheet.ciiva.com/2042/cd00003395-2042199.pdf?src-supplier=Digikey; ComponentLink2Description: https://datasheet.ciiva.com/2042/cd00003395-2042199.pdf?src-supplier=Digikey; ComponentLink3URL: https://datasheet.ciiva.com/2042/cd00003395-2042198.pdf?src-supplier=Digikey; ComponentLink3Description: https://datasheet.ciiva.com/2042/cd00003395-2042198.pdf?src-supplier=Digikey; ComponentLink4URL: https://datasheet.ciiva.com/2042/cd00003395-2042200.pdf?src-supplier=Digikey; ComponentLink4Description: https://datasheet.ciiva.com/2042/cd00003395-2042200.pdf?src-supplier=Digikey
X2 = Crystal 8MHZ 20PF 20PPM H1OED8K5: HC-49US 8MHZ 20PF 20PPM H1OED8K5; Manufacturer: YXC; Equivalent Series Resistance: 60OHMs; ComponentLink1Description: Datasheet; ComponentLink1URL: https://mm.digikey.com/Volume0/opasdata/d220001/medias/docus/4129/HC-49US_Dip.pdf; Series: HC-49US; Frequency Stability: 20ppm; Load Capacitance: 20pF; Mounting Type: Through Hole; Height-Size-Dimension: 0.145" (3.68mm)-0.453" L x 0.177" W (11.50mm x 4.50mm)